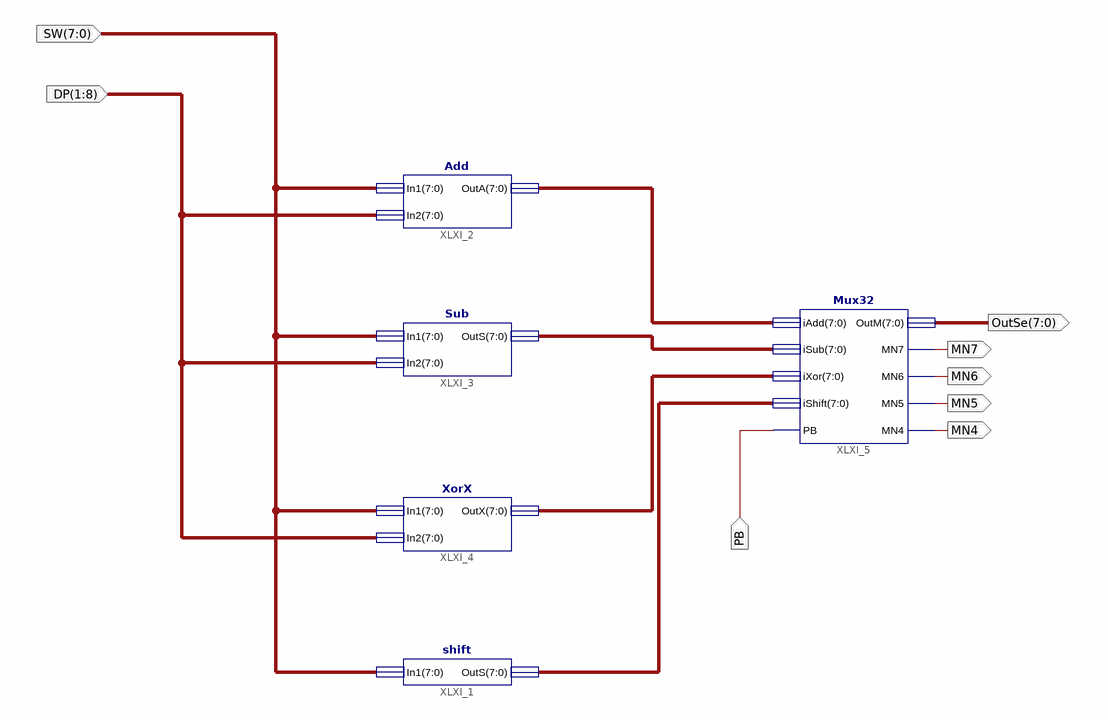
[diagram p0: schematic sheet 1]
// Xilinx ISE schematic Selectt.sch (spartan6) as structural Verilog: 5 symbols, 8 ports
module Selectt (
  input  [7:0] SW,
  input  [1:8] DP,
  input  PB,
  output [7:0] OutSe,
  output MN7,
  output MN6,
  output MN5,
  output MN4
);

  wire [7:0] XLXN_9, XLXN_10, XLXN_11, XLXN_12;

  shift XLXI_1 (.In1(SW), .OutS(XLXN_12));
  Add XLXI_2 (.In1(SW), .In2(DP), .OutA(XLXN_9));
  Sub XLXI_3 (.In1(SW), .In2(DP), .OutS(XLXN_10));
  XorX XLXI_4 (.In1(SW), .In2(DP), .OutX(XLXN_11));
  Mux32 XLXI_5 (
    .iAdd(XLXN_9), .iShift(XLXN_12), .iSub(XLXN_10), .iXor(XLXN_11), .MN4(MN4), .MN5(MN5), .MN6(MN6),
    .MN7(MN7), .OutM(OutSe), .PB(PB));
endmodule
